# Altium schematic sheet MAIN_SHEET.SchDoc: MODBUS TO DASH7
size B; DrawnBy: Kwinten Schram; SheetNumber: 1; SheetTotal: 3; ENG_APP_DATE: --/--/--; DSN_APP_DATE: --/--/--; CHK_APP_DATE: --/--/--
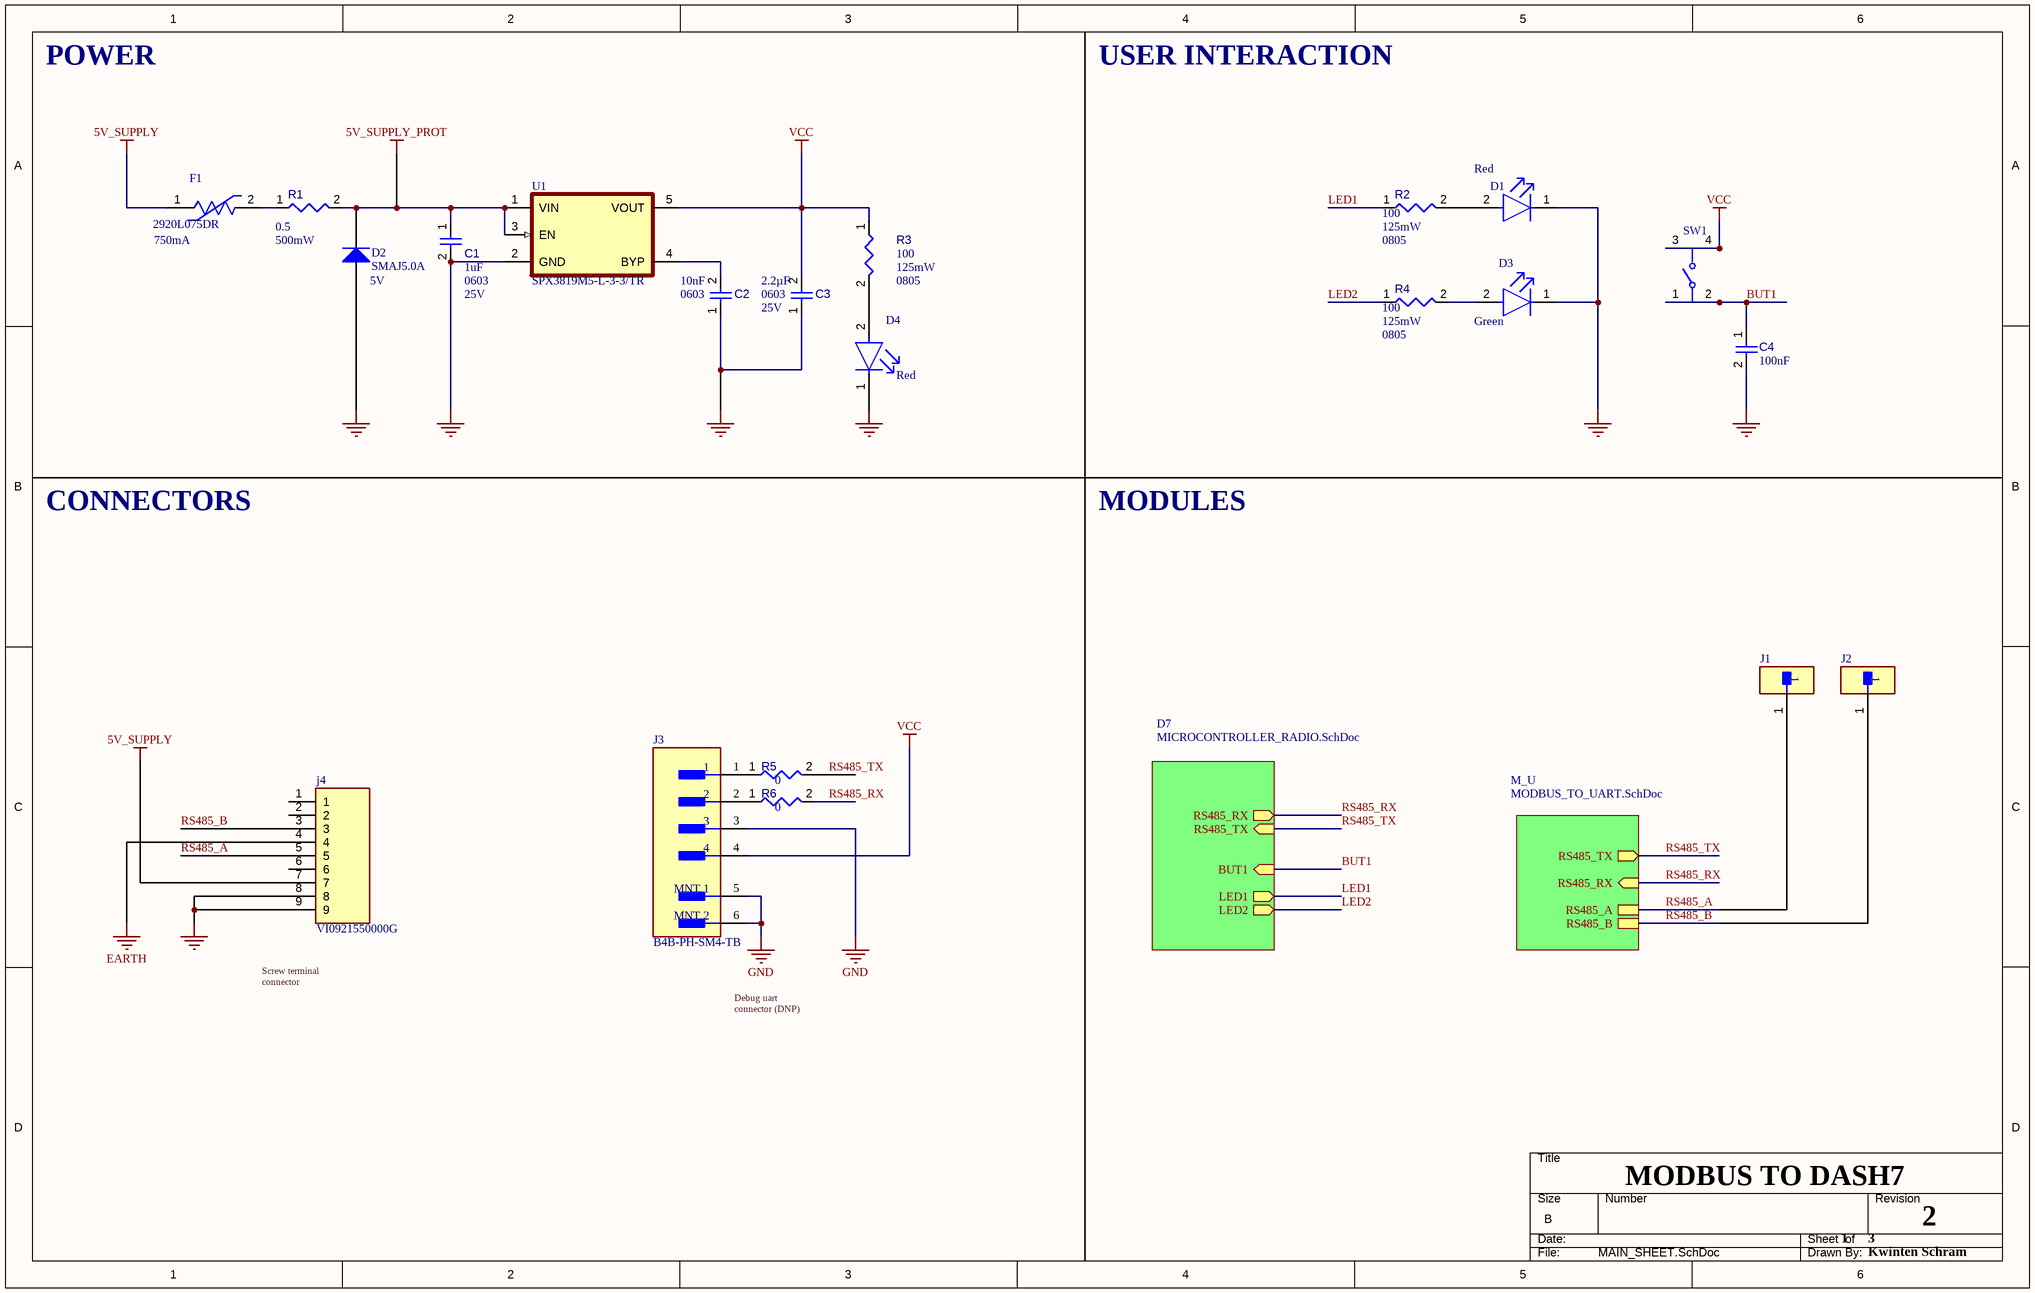
[diagram p0: MAIN_SHEET.SchDoc]

## Parts
C1  Capacitance: 1uF  Voltage Rating: 25V  Case/Package: 0603  [FP-CC0603-DA-MFG]  (hidden comment: CC0603KPX7R8BB105)
C2  value 10nF  Case/Package: 0603  [FP-C0603C-CF-IPC_B]  (hidden comment: C0603C103K2RACTU)
C3  value 2.2µF  Case/Package: 0603  Rated DC Voltage (URdc): 25V  [FP-GRM188-0_2-IPC_C]  (hidden comment: GRM188Z71E225KE43D)
C4  value 100nF  [FP-0603-L_1_6_0_15-W_0_81-MFG]  (hidden comment: 06033C104KAT2A)
D1  Color: Red  [FP-APT1608EC-MFG]  (hidden comment: APT1608SURCK)
D2  SMAJ5.0A  Forward Voltage: 5V  [BOUR-SMA-2_V]
D3  Color: Green  [FP-APG1608CGKC-T-MFG]  (hidden comment: APG1608CGKC/T)
D4  Color: Red  [FP-APT1608EC-MFG]  (hidden comment: APT1608SURCK)
F1  2920L075DR  Current Rating: 750mA  [FP-2920L050DR-MFG]
J1  PBC01SAAN  [FP-PBC01SAAN-MFG]  (value not drawn)
J2  PBC01SAAN  [FP-PBC01SAAN-MFG]  (value not drawn)
J3  B4B-PH-SM4-TB  [FP-B4B-PH-SM4-TB-MFG]
j4  VI0921550000G  [VI0921550000G-Footprint-1]
R1  value 0.5  Power: 500mW  [RESC3126X65X50NL10T20]  (hidden comment: RL1210FR-070R5L)
R2  value 100  Case/Package: 0805  Power: 125mW  [FP-AC0805-IPC_A]  (hidden comment: AC0805FR-07100RL)
R3  value 100  Case/Package: 0805  Power: 125mW  [FP-AC0805-IPC_A]  (hidden comment: AC0805FR-07100RL)
R4  value 100  Case/Package: 0805  Power: 125mW  [FP-AC0805-IPC_A]  (hidden comment: AC0805FR-07100RL)
R5  value 0  [FP-CRCW0402-e3-IPC_A]  (hidden comment: CRCW04020000Z0ED)
R6  value 0  [FP-CRCW0402-e3-IPC_A]  (hidden comment: CRCW04020000Z0ED)
SW1  PTS526SK15SMTR2LFS  [FP-PTS526SK15SMTR2LFS-MFG]  (value not drawn)
U1  SPX3819M5-L-3-3/TR  [SOT95P280X145-5N]

## Sub-sheets
D7 = MICROCONTROLLER_RADIO.SchDoc: RS485_RX (out), RS485_TX (in), BUT1 (in), LED1 (out), LED2 (out)
M_U = MODBUS_TO_UART.SchDoc: RS485_TX (out), RS485_A, RS485_RX (in), RS485_B

## Nets
5V_SUPPLY: F1.1 j4.7
5V_SUPPLY_PROT: C1.1 D2.2(K) R1.2 U1.1(VIN) U1.3(EN)
EARTH: j4.4
GND: C1.2 C2.1 C3.1 C4.2 D1.1(C) D2.1(A) D3.1(C) D4.1(C) J3.3 J3.5(MNT_1) J3.6(MNT_2) j4.8 j4.9 U1.2(GND)
VCC: C3.2 J3.4 R3.1 SW1.3 SW1.4 U1.5(VOUT)
BUT1: C4.1 SW1.1 SW1.2 ; sheet D7/BUT1
LED1: R2.1 ; sheet D7/LED1
LED2: R4.1 ; sheet D7/LED2
RS485_A: J1.1 j4.5 ; sheet M_U/RS485_A
RS485_B: J2.1 j4.3 ; sheet M_U/RS485_B
RS485_RX: R6.2 ; sheet M_U/RS485_RX, sheet D7/RS485_RX
RS485_TX: R5.2 ; sheet M_U/RS485_TX, sheet D7/RS485_TX
NetC2_2: C2.2 U1.4(BYP)
NetD1_2: D1.2(A) R2.2
NetD3_2: D3.2(A) R4.2
NetD4_2: D4.2(A) R3.2
NetF1_2: F1.2 R1.1
NetJ3_1: J3.1 R5.1
NetJ3_2: J3.2 R6.1

Not connected (* = marked no-connect by the designer): j4 1 2 6

## Notes on the sheet
- POWER
- USER INTERACTION
- CONNECTORS
- MODULES
- Screw terminal connector
- Debug uart connector (DNP)
- 2
- DWG. NO.
- REV.
- SHT.
- THIS DOCUMENT AND THE DATA DISCLOSED HEREIN OR HEREWITH IS THE PROPERTY OF ALTIUM LIMITED AND MAY BE FREELY DISTRIBUTED IN WHOLE. NO RIGHTS ARE RESERVED OR EXPRESS OR IMPLIED WARANTEE GIVEN.
- REVISION
- DESCRIPTION
- DATE
- APPROVED
- ENG:
- APPROVALS
- PROJECT
- DSN:
- CHK:
- REFERENCE DOCUMENTS
- PROJECT REVISION:
- TITLE
- DOCUMENT REVISION:
- DESIGN ITEM:
- BOM:
- FAB DWG:
- PCB DWG:
- ASSY DWG:
- SCALE:
- SIZE
- B
- CAGE CODE
- FILE NAME
- DWG NO.
- SHEET
- OF
- REV

## Library data of the parts
C1 = CMP-001-00009-4: Ceramic Capacitor, Multilayer, Ceramic, 25V, 10% +Tol, 10% -Tol, X7R, 15% TC, 1uF, Surface Mount, 0603; Multilayer: Yes; Dielectric Material: Ceramic; Number of Pins: 2; Min Operating Temperature: -55°C; Width: 0.8mm; Height: 0.8mm; Length: 1.6mm; Max Operating Temperature: 125°C; Tolerance: 10%; Packaging: Tape and Reel; RoHS Compliant: Yes; REACH SVHC: Yes; Pins: 2; Rated DC Voltage (URdc): 25V; Size Code: 0603; Terminal Finish: Nickel; JESD-609 Code: e3; Negative Tolerance: 10%; Temperature Characteristics Code: X7R; Package Style: SMTMeter; Capacitor Type: Ceramic; Positive Tolerance: 10%
C2 = CMP-001-00038-1: Ceramic Capacitor, Multilayer, Ceramic, 200V, 10% +Tol, 10% -Tol, X7R, 15% TC, 0.01uF, Surface Mount, 0603; Multilayer: Yes; JESD-609 Code: e3; Package Shape: Rectangular; RoHS Compliant: Yes; Dielectric Material: Ceramic; Termination: Wraparound; Min Operating Temperature: -55°C; Packaging: Tape and Reel; Mounting Technology: Surface Mount; Temperature Characteristics Code: X7R; Pins: 2; Max Operating Temperature: 125°C; Capacitor Type: Ceramic; Terminal Finish: Nickel; Tolerance: 10%; Rated DC Voltage (URdc): 200V; Reach SVHC Compliant: Yes; Width: 0.8mm; Height: 0.8mm; Length: 1.6mm; Tolerance  (fill in as +-): 10%; Package Style: SMTMeter; Tolerance (fill in as +-): 10%
C3 = CMP-001-00039-1: Ceramic Capacitor, Multilayer, Ceramic, 25V, 10% +Tol, 10% -Tol, X7R, 15% TC, 2.2uF, Surface Mount, 0603; Multilayer: Yes; JESD-609 Code: e3; Package Shape: Rectangular; RoHS Compliant: Yes; Dielectric Material: Ceramic; Termination: Wraparound; Min Operating Temperature: -55°C; Packaging: Tape and Reel; Mounting Technology: Surface Mount; Temperature Characteristics Code: X7R; Pins: 2; Max Operating Temperature: 125°C; Capacitor Type: Ceramic; Terminal Finish: Nickel; Tolerance: 10%; Reach SVHC Compliant: Yes; Tolerance  (fill in as +-): 10%; Tolerance (fill in as +-): 10%
C4 = CMP-001-00020-3: Ceramic Capacitor, Multilayer, Ceramic, 25V, 10% +Tol, 10% -Tol, X7R, 15% TC, 0.1uF, Surface Mount, 0603; Multilayer: Yes; Height: 0.9mm; Tolerance: 10%; Reach SVHC Compliant: Yes; Package Shape: Rectangular; Max Operating Temperature: 125°C; Rated DC Voltage (URdc): 25V; Min Operating Temperature: -55°C; Dielectric Material: Ceramic; Capacitor Type: Ceramic; Case/Package: 0603; Pins: 2; JESD-609 Code: e3; Package Style: SMTMeter; Termination: Wraparound; RoHS Compliant: Yes; Length: 1.6mm; Temperature Characteristics Code: X7R; Tolerance (fill in as +-): 10%; Tolerance  (fill in as +-): 10%; Packaging: Tape and Reel; Mounting Technology: Surface Mount; Width: 0.81mm; Terminal Finish: Nickel
D1 D4 = CMP-007-00012-2: Single Color LED, Hyper Red, Water Clear, 1.2mm; Overall Height: 0.75mm; Viewing Angle: 120°; Shape: Rectangular; Luminous Intensity-Nom: 150mcd; Channels: 1; Forward Current: 30mA; Min Operating Temperature: -40°C; Packaging: Tape and Reel; Pins: 2; Max Operating Temperature: 85°C; Lens Style: WATER CLEAR; Size: 1.2mm; Mounting Technology: Surface Mount; RoHS Compliant: Yes; Terminal Pitch: 1.65mm; Optoelectronic Device Type: SINGLE COLOR LED; Reach SVHC Compliant: Yes
D2 = CMP-004-00017-1: Trans Voltage Suppressor Diode, 400W, 5V V(RWM), Unidirectional, 1 Element, Silicon, DO-214AC; Qualification Status: Not Qualified; Breakdown Voltage-Nom: 6.7V; Number of Elements: 1; Max Breakdown Voltage: 7V; Min Breakdown Voltage: 6.4V; Package Body Material: Plastic; Terminal Finish: Tin; Pins: 2; RoHS Compliant: Yes; Reach SVHC Compliant: No; Terminal Form: C BEND; Surface Mount: Yes; Polarity: Unidirectional; Package Shape: Rectangular; JESD-609 Code: e3; Max Operating Temperature: 150°C; JESD-30 Code: R-PDSO-C2; Moisture Sensitivity Level: 1; Package Style: SMALL OUTLINEMeter; Non-rep Peak Rev Power Dis-Max: 400W; Technology: AVALANCHE; Terminal Position: DUAL; Min Operating Temperature: -55°C; Diode Type: TRANS VOLTAGE SUPPRESSOR; Diode Element Material: SILICON; Rep Pk Reverse Voltage-Max: 5V; JEDEC-95 Code: DO-214AC
D3 = CMP-007-00010-1: Single Color LED, Green, Water Clear, 1.2mm; Forward Current: 30mA; Viewing Angle: 120°; Luminous Intensity-Nom: 60mcd; Channels: 1; Shape: Rectangular; Overall Height: 0.25mm; RoHS Compliant: Yes; Pins: 2; Min Operating Temperature: -40°C; Terminal Pitch: 1.65mm; Lens Style: WATER CLEAR; Optoelectronic Device Type: SINGLE COLOR LED; Max Operating Temperature: 85°C; Packaging: Tape and Reel; Mounting Technology: Surface Mount; Size: 1.2mm
F1 = CMP-005-00008-1: PTC Thermistor, 30V, 0.35ohm, Surface Mount; Thermistor Application: OVERLOAD PROTECTION; Reference Standard: UL; Package Length: 7.98mm; Package Height: 1.25mm; Package Width: 5.44mm; Value: 1R; Package Shape: Rectangular; Pins: 2; RoHS Compliant: Yes; Termination: Wraparound; Reach SVHC Compliant: Yes; Terminal Finish: Tin; Max Operating Temperature: 85°C; Resistor Type: PTC RESETTABLE FUSE; JESD-609 Code: e3; Packaging: Tape and Reel; Terminal Placement: Dual Ended; Mounting Technology: Surface Mount; Min Operating Temperature: -40°C; Working Voltage: 30V
J1 J2 = CMP-002-00033-2: Board Connector, 1 Contact(s), 1 Row(s), Male, Straight, 0.1 inch Pitch, Solder Terminal; Number of Contacts: 1; Reliability: COMMERCIAL; Plating Thickness: 10uin; Reference Standard: UL; Contact Pattern: RECTANGULAR; Contact Style: SQ PIN-SKT; Rated Current (Signal): 3A; Insulation Material: Polybutylene; Connector Type: BOARD CONNECTOR; Body Length: 0.1inch; Contact Finish - Mating: AU ON NI; Mounting Technology: Board; Contact Gender: Male; Number Of Connectors: 1; Contact Material: Bronze; Number of Rows Loaded: 1; Manufacturer Series: PBC01SAAN; Min Operating Temperature: -65°C; Contact Finish - Termination: Matte Tin (Sn) - with Nickel (Ni) barrier; Mounting Style: STRAIGHT; Terminal Pitch: 2.54mm; Reach SVHC Compliant: Yes; Number Of PCB Rows: 1; Termination: Solder; JESD-609 Code: e3; RoHS Compliant: Yes; Body Depth: 0.1inch; Mating Contact Pitch: 0.1inch; Terminal Length: 0.12inch; Body Breadth: 0.1inch; Max Operating Temperature: 125°C
J3 = CMP-002-00008-1: Header B4B-PH-SM4-TB, 2.00mm, 4-contacts, top entry, SMT /1000/reel
j4 = CMP-002-00032-2: Barrier Strip Terminal Block; RoHS Compliant: Yes; Terminal and Terminal Block Type: BARRIER STRIP TERMINAL BLOCK; Reach SVHC Compliant: Yes
R1 = CMP-009-00086-1: Fixed Resistor, Metal Glaze/thick Film, 0.5W, 0.5ohm, 0.5V, 1% +/-Tol, 300ppm/Cel, Surface Mount, 1210; Manufacturer Series: RL; Package Length: 3.1mm; Package Width: 2.6mm; Additional Feature: LASER TRIMMABLE; Rated Temperature: 70°C; Temperature Coefficient: 300ppm/°C; Package Height: 0.55mm; Terminal Finish: Nickel; RoHS Compliant: Yes; Package Shape: Rectangular; Min Operating Temperature: -55°C; Packaging: Tape and Reel; Series: RL; Technology: METAL GLAZE/THICK FILM; JESD-609 Code: e3; Pins: 2; Termination: Wraparound; Reach SVHC Compliant: Yes; Mounting Technology: Surface Mount; Max Operating Temperature: 125°C; Package Style: SMTMeter; Resistor Type: FIXED RESISTOR; Construction: Chip; Case/Package: 1210; Tolerance: 1%
R2-R4 = CMP-009-00088-1: Fixed Resistor, Metal Glaze/thick Film, 0.125W, 100ohm, 150V, 1% +/-Tol, 100ppm/Cel, Surface Mount, 0805; Package Length: 2mm; Temperature Coefficient: 100ppm/°C; Package Height: 0.5mm; Additional Feature: LASER TRIMMABLE; Reference Standard: AEC-Q200; Package Width: 1.25mm; Rated Temperature: 70°C; Terminal Finish: Nickel; Min Operating Temperature: -55°C; Mounting Technology: Surface Mount; JESD-609 Code: e3; Reach SVHC Compliant: Yes; Pins: 2; Resistor Type: FIXED RESISTOR; Tolerance: 1%; Packaging: Tape and Reel; RoHS Compliant: Yes; Termination: Wraparound; Technology: METAL GLAZE/THICK FILM; Package Shape: Rectangular; Working Voltage: 150V; Construction: Chip; Max Operating Temperature: 155°C; Package Style: SMTMeter
R5 R6 = CMP-009-00087-1: Metal Glaze/thick Film, 0.063W, 0ohm, Surface Mount, 0402; Power: 63mW; Package Length: 1mm; Package Width: 0.5mm; Reference Standard: AEC-Q200; Rated Temperature: 70°C; Package Height: 0.35mm; Min Operating Temperature: -55°C; Max Operating Temperature: 155°C; Pins: 2; Case/Package: 0402; RoHS Compliant: Yes; Mounting Technology: Surface Mount; Termination: Wraparound; Terminal Finish: Nickel; Reach SVHC Compliant: Yes; Technology: METAL GLAZE/THICK FILM; Package Shape: Rectangular; JESD-609 Code: e3; Package Style: SMTMeter; Construction: Chip; Packaging: Tape and Reel; Resistor Type: FIXED RESISTOR
SW1 = CMP-10040-000013-1: TACT 5.2 X 5.2, 1.5 MM H, 260GF,; Manufacturer: C&K; Operating Force: 250gf; Throw Configuration: SPST-NO; Contact Current Rating: 50mA; Standoff Height: 0mm; Contact Resistance: 100mΩ; Voltage Rating Dc: 12V; Electromechanical Life: 200000Cycles; Device Class L3: Tactile Switches; Device Class L2: Switches; Temperature: -20°C to +70°C; Temperature Range Low: -20°C; Package: PTS526SK15SMTR2LFS; Temperature Range High: +70°C; ComponentLink2Description: Datasheet; Device Class L1: Electromechanical; Height: 1.65mm; Digikey Description: TACT 5.2 X 5.2, 1.5 MM H, 260GF,; Category: Switch; RoHS: TRUE; Automotive: No; Lead Free: Yes; Manufacturer Part Number: PTS526SK15SMTR2LFS; Octopart: https://octopart.com/pts526+sk15+smtr2+lfs-c%26k+components-100617999; ComponentLink2URL: https://www.ckswitches.com/media/2780/pts526.pdf
U1 = CMP-031-00000-4: Fixed Positive LDO Regulator, 3.3V, 0.7V Dropout, PDSO5; MF: MaxLinear, Inc.; Max Supply Voltage: 16V; Regulator Type: FIXED POSITIVE SINGLE OUTPUT LDO REGULATOR; Package Body Material: Plastic; Output Current1-Max: 500mA; Output Voltage1-Max: 3.333V; Dropout Voltage1-Max: 700mV; Min Input Voltage: 2.5V; Channels: 1; Time @ Peak Reflow Temperature-Max (s): 40s; Output Voltage1-Min: 3.267V; Qualification Status: Not Qualified; Source: SPX3819M5-L-3-3.SchLib; MP: SPX3819M5-L-3-3/TR; Purchase-URL: https://pricing.snapeda.com/search/part/SPX3819M5-L-3-3/TR/?ref=eda; Value: *; Check_prices: https://www.snapeda.com/parts/SPX3819M5-L-3-3/TR/MaxLinear,%20Inc./view-part/35586/?ref=eda; Pins: 5; SnapEDA_Link: https://www.snapeda.com/parts/SPX3819M5-L-3-3/TR/MaxLinear,%20Inc./view-part/35586/?ref=snap; Component Type: Standard; Case/Package: LSSOP; Digi-Key_Part_Number: 1016-1873-1-ND; Design Item ID: SPX3819M5-L-3-3; RoHS Compliant: Yes; Terminal Pitch: 0.95mm; JESD-30 Code: R-PDSO-G5; Width: 1.6mm; Terminal Form: Gull Wing; Package Style: SMALL OUTLINE, LOW PROFILE, SHRINK PITCHMeter; Operating Temperature, TJ-Min: -40°C; Moisture Sensitivity Level: 1; Surface Mount: Yes; Output Voltage1-Nom: 3.3V; Package Shape: Rectangular; Operating Temperature, TJ-Max: 125°C; Reach SVHC Compliant: Yes; Terminal Finish: Tin; JESD-609 Code: e3; Height - Seated (Max): 1.45mm; Peak Reflow Temperature (Cel): 260°C; Terminal Position: DUAL; Length: 2.9mm